# EAGLE design Humidity (EAGLE 9.6.2)
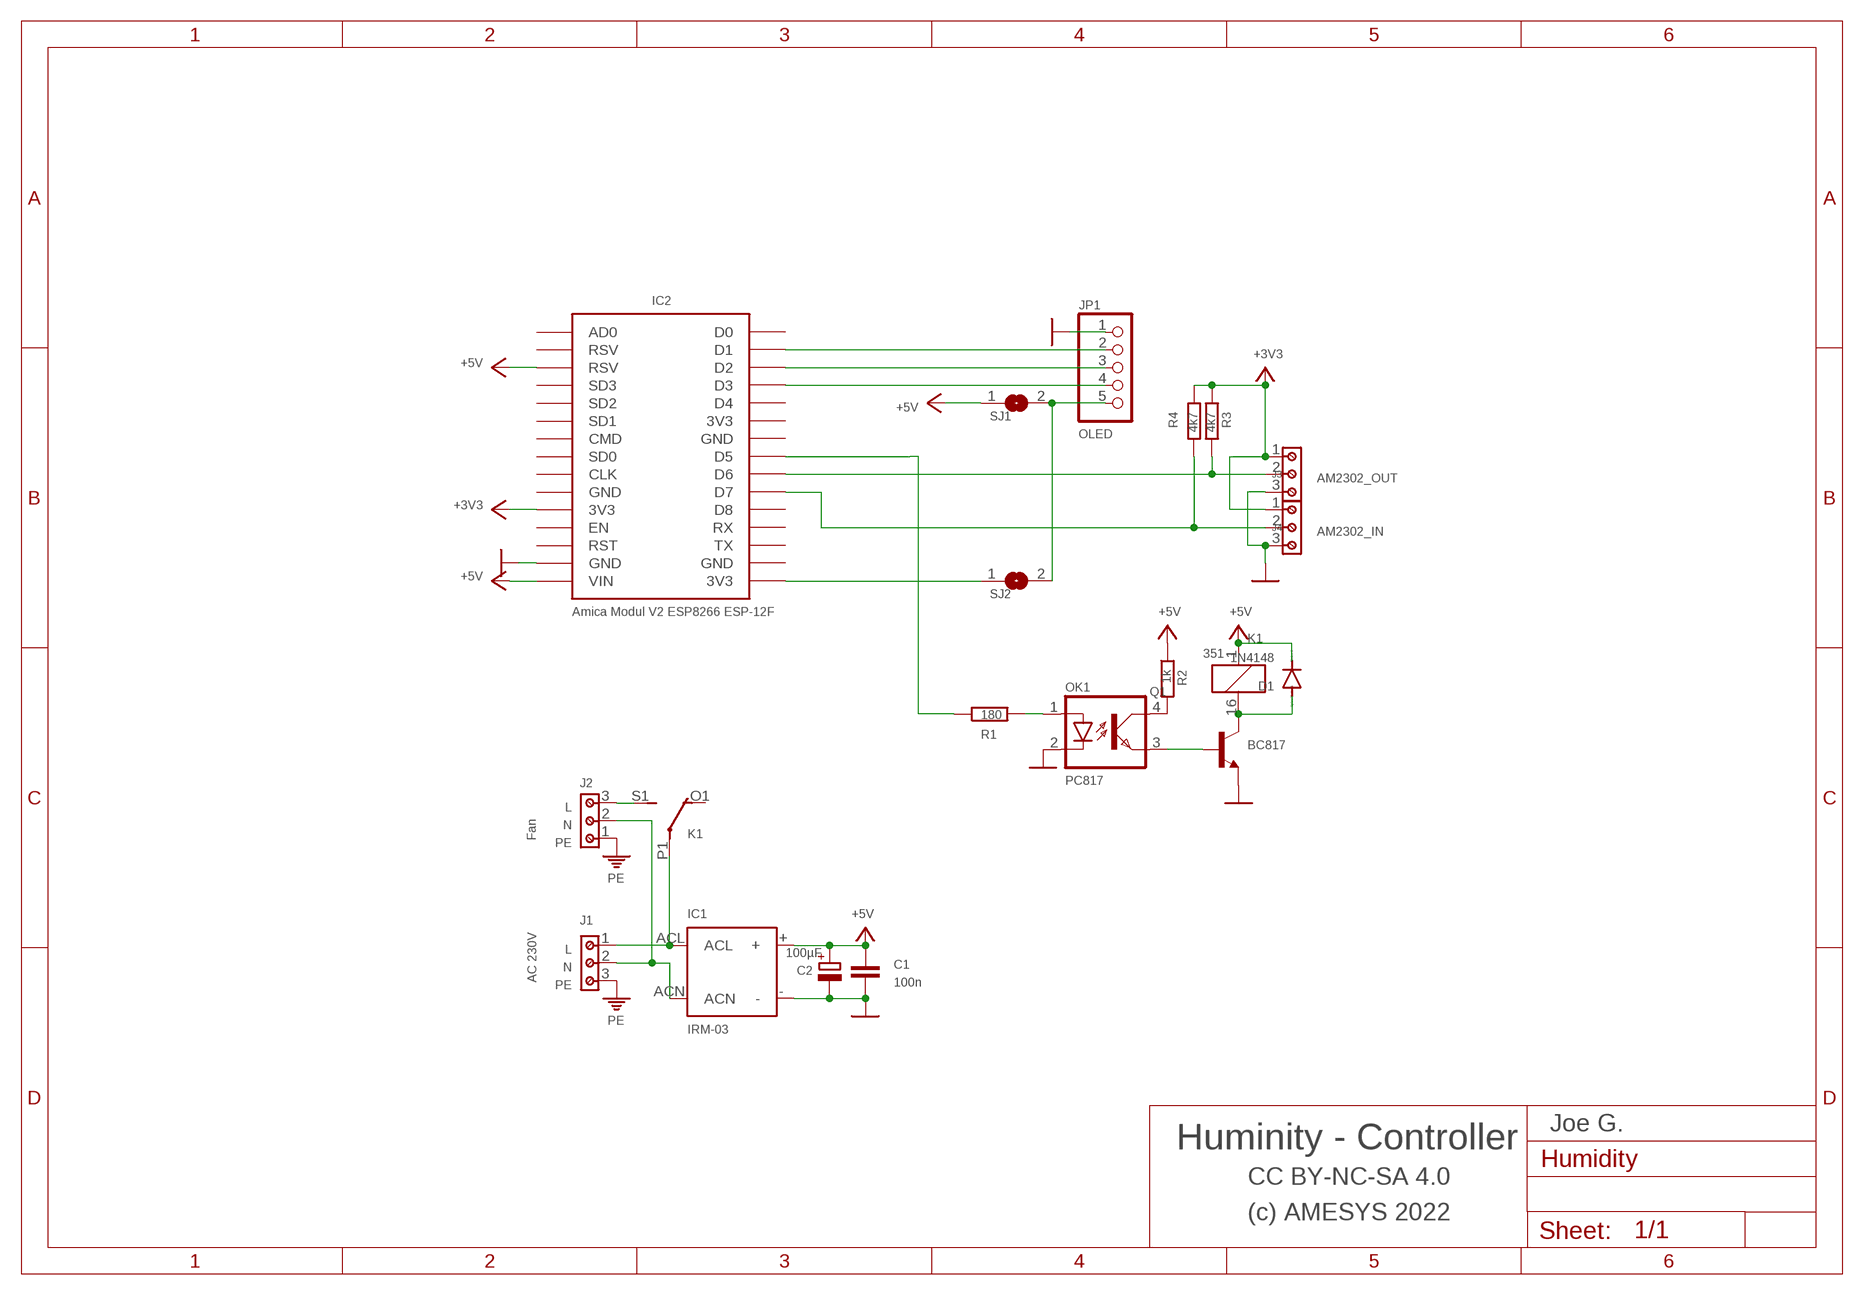
[diagram p0: schematic, sheet 1]

## Parts
C1  100n  C-EUC1206  [C1206]
C2  100µF  CPOL-EUSMCC  [SMC_C]
D1  1N4148  DIODE-SOD123  [SOD123]
IC1  IRM-03  [IRM-03]
IC2  Amica Modul V2 ESP8266 ESP-12F  ESP12E_DEVKIT  [ESP12E_DEVKIT]
J1  AC 230V  691216910003  [691216910003]
J2  Fan  691216910003  [691216910003]
J3  AM2302_OUT  691216710003  [691216710003]
J4  AM2302_IN  691216710003  [691216710003]
JP1  OLED  PINHD-1X5  [1X05]
K1  351  [351]
OK1  PC817  [DIL04]
Q1  BC817  TRANSISTOR-NPN_BC817SMD  [TRANSISTOR-NPN_SOT23-BEC]
R1  180  R-EU_R1206  [R1206]
R2  1k  R-EU_M1206  [M1206]
R3  4k7  R-EU_M1206  [M1206]
R4  4k7  R-EU_M1206  [M1206]
SJ1  SJ  [SJ]
SJ2  SJ  [SJ]

## Nets
+3V3: IC2.3V3@0(3V3) J3.1 J4.1 R3.1 R4.1
+5V: C1.1 C2.+ D1.C IC1.+ IC2.RSV@1(RSV) IC2.VIN K1.1 R2.1 SJ1.1
GND: C1.2 C2.- IC1.- IC2.GND@1(GND) J3.3 J4.3 JP1.1 OK1.2(C) Q1.E
N$1: IC2.D6 J3.2 R3.2
N$2: IC2.D7 J4.2 R4.2
N$3: JP1.5 SJ1.2 SJ2.2
N$4: IC1.ACL J1.1 K1.P1(2:P)
N$5: IC1.ACN J1.2 J2.2
N$6: OK1.1(A) R1.2
N$7: OK1.4(COL) R2.2
N$8: D1.A K1.16 Q1.C
N$9: OK1.3(EMIT) Q1.B
N$10: J2.3 K1.S1(2:S)
N$11: IC2.D1 JP1.2
N$12: IC2.D2 JP1.3
N$13: IC2.D3 JP1.4
N$14: IC2.3V3@2(3V3) SJ2.1
PE: J1.3 J2.1
REL: IC2.D5 R1.1
Unconnected: IC2.3V3@1(3V3) IC2.AD0 IC2.CLK IC2.CMD IC2.D0 IC2.D4 IC2.D8 IC2.EN IC2.GND@0(GND) IC2.GND@2(GND) IC2.GND@3(GND) IC2.RST IC2.RSV@0(RSV) IC2.RX IC2.SD0 IC2.SD1 IC2.SD2 IC2.SD3 IC2.TX K1.O1(2:O) K1.O2(3:O) K1.P2(3:P) K1.S2(3:S)

## Notes on the sheet
- L
- N
- PE
- L
- N
- PE
- Joe G.
- Huminity - Controller
- CC BY-NC-SA 4.0
- (c) AMESYS 2022

## Library data of the parts
C1 = rcl:C-EU: CAPACITOR, European symbol; SPICEPREFIX: C
C2 = rcl:CPOL-EU: POLARIZED CAPACITOR, European symbol; SPICEPREFIX: C
D1 = diode:DIODE-: DIODE
IC1 = meanwell:IRM-03
IC2 = ESP12E_DEVKIT:ESP12E_DEVKIT: ESP12E DEVKIT BOARD
J1 J2 = Eagle_WR-TBL Rising Cage Clamp (rev20a):691216910003: WR-TBL Serie 2169 - 7.50 mm Horizontal Entry Modular w. Rising Cage Clamp KIND PROPERTIES Pitch 7.5 mm MATERIAL PROPERTIES Insulator Material PA66 Insulator Flammability Rating UL94 V-0 Contact Material Copper Alloy Contact Plating Tin over Nickel Contact Type Stamped Terminal Screw Material Steel Terminal Screw Plating Zinc Wire Guard Material Copper Alloy GENERAL INFORMATION Operating Temperature -30 up to +120 °C Compliance ROHS & Reach ELECTRICAL PROPERTIES IR UL 14 A IR VDE 24 A Working Voltage [UL] 300 V (AC) Working Voltage [VDE] 750 V (AC) Withstanding Voltage [UL] 1600 V (AC) Withstanding Voltage [VDE] 3000 V (AC) Contact Resistance 20 mΩ MECHANICAL PROPERTIES Wire Strip Length 6 Screw M3 CERTIFICATION UL Approval E150931 VDE Approval 40021356 PACKAGING PROPERTIES Packaging Box <https://www.we-online.com/catalog/media/o32871v209%20Family_WR-TBL2_Series2169.jpg> Details see: https://www.we-online.com/catalog/en/TBL_7_50_2169_HORIZONTAL_ENTRY_MODULAR_69121691000x/ Updated by Ella Wu 2019-11-27 2019(C) Wurth Elektronik; IR-UL: 14A; IR-VDE: 24A; PART-NUMBER: 691216910003; PINS: 3; PITCH: 7.5mm; TYPE: Horizontal; WIRE: 12 to 30 (AWG) 3.31 to 0.0509 (mm²); WORKING-VOLTAGE-UL: 300V (AC); WORKING-VOLTAGE-VDE: 750V (AC)
J3 J4 = Eagle_WR-TBL Rising Cage Clamp (rev20a):691216710003: WR-TBL Serie 2167 - 5.00 mm Horizontal Entry Modular w. Rising Cage Clamp KIND PROPERTIES Pitch 5 mm MATERIAL PROPERTIES Insulator Material PA6/66 Insulator Flammability Rating UL94 V-0 Insulator Color Green Contact Material Copper Alloy Contact Plating Nickel over Tin Contact Type Stamped Terminal Screw Material Steel Terminal Screw Plating Zinc Wire Guard Material Copper Alloy GENERAL INFORMATION Operating Temperature -30 up to +120 °C Compliance Lead free / RoHS ELECTRICAL PROPERTIES IR UL 14 A IR VDE 24 A Working Voltage [UL] 300 V (AC) Working Voltage [VDE] 250 V (AC) Withstanding Voltage [UL] 1600 V (AC) Withstanding Voltage [VDE] 2000 V (AC) Contact Resistance 20 mΩ Contact Resistance [UL] 20 mΩ Contact Resistance [VDE] 20 mΩ MECHANICAL PROPERTIES Wire Strip Length 6 (mm) Screw M3 CERTIFICATION UL Approval E150931 CAT. N°: CLL (4) VDE Approval 40021356 VDE Approval 40021356 TYPE: CLL PACKAGING PROPERTIES Packaging Box <https://www.we-online.com/catalog/media/o32862v209%20Family_Con_TBL_Screw_RisingClamp_5_6912167100xx_pf2.jpg> Details see: https://www.we-online.com/catalog/en/TBL_5_00_2167_HORIZONTAL_ENTRY_W_RISING_CAGE_69121671000x/ Updated by Ella Wu 2019-11-22 2019(C) Wurth Elektronik; DATASHEET-URL: https://www.we-online.com/catalog/datasheet/691216710003.pdf; IR-UL: 14A; IR-VDE: 24A; MOUNT: THT; PART-NUMBER: 691216710003; PINS: 3; PITCH: 5mm; TYPE: Horizontal; WIRE: 30 to 12 (AWG) 0.05 to 3.31 (mm²); WORKING-VOLTAGE-UL: 300V (AC); WORKING-VOLTAGE-VDE: 250V (AC)
JP1 = pinhead:PINHD-1X5: PIN HEADER
K1 = relay:351: RELAY 2 x switch, Omron; OC_FARNELL: unknown; OC_NEWARK: unknown
OK1 = optocoupler:PC817: SHARP OPTO COUPLER; MPN: PC817X4J000F; OC_FARNELL: 9707727; OC_NEWARK: 97K7059
Q1 = Aeternum:TRANSISTOR-NPN_BC817*: NPN Transistor
R1-R4 = rcl:R-EU_: RESISTOR, European symbol; SPICEPREFIX: R
SJ1 SJ2 = jumper:SJ: SMD solder JUMPER

## Board
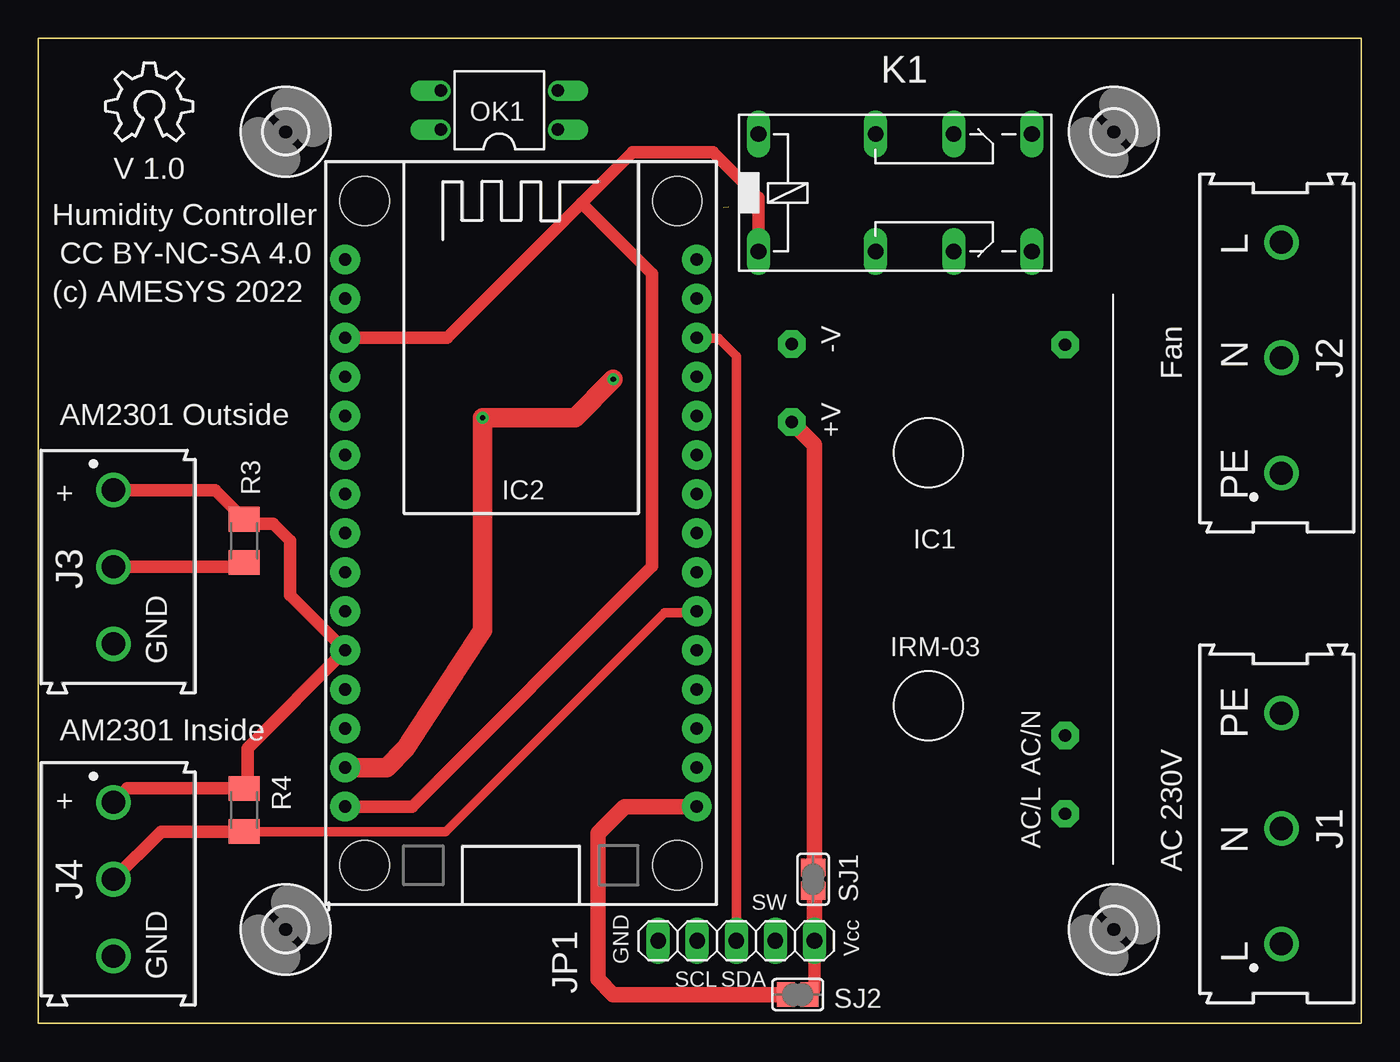
[diagram p1: board, top side]
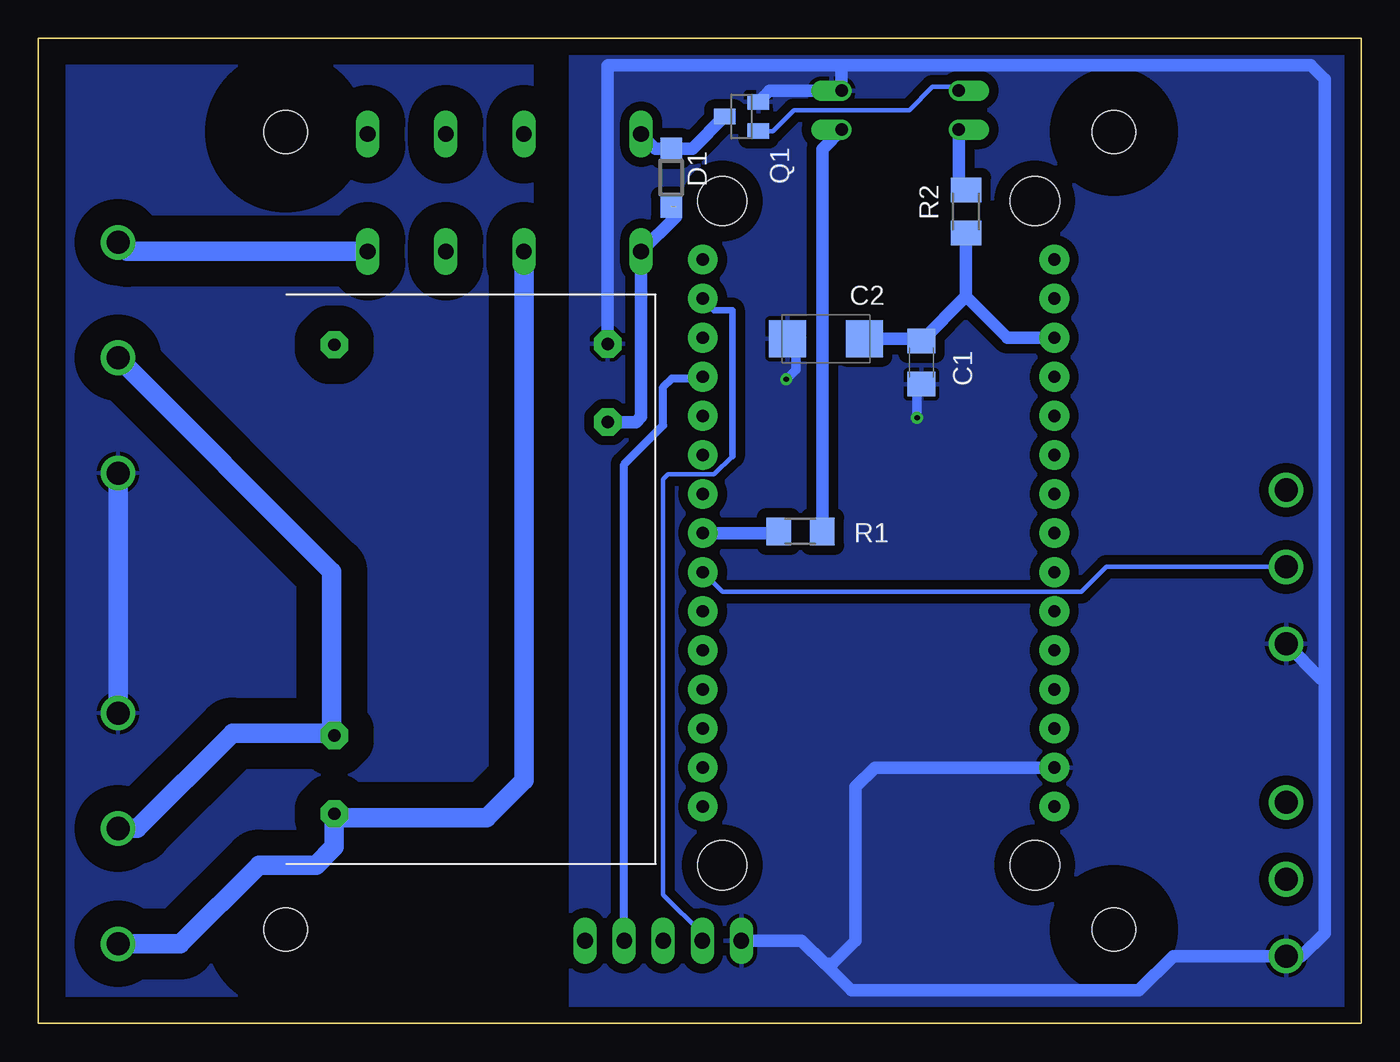
[diagram p2: board, bottom side, seen from below]

Size 86 x 64 mm. Coordinates in mm from the lower left corner, seen from the top.
Outline: 0,0 0,64 86,64 86,0 0,0
Copper layers (1*16): Top 0.035mm / dielectric 1.5mm / Bottom 0.035mm
Design rules "default": minimum track width 6mil, minimum drill 0.35mm, track to track 6mil, track to pad 6mil, pad to pad 6mil, via to via 6mil, smd to smd 6mil, copper to edge 40mil, drill to drill 6mil, minimum pad ring 10mil, minimum via ring 8mil, stop-mask expansion 4mil, vias tented up to drill 0mil, thermal gap 10mil

### Footprints (pad centres in the part's own frame; a part is rotated, then mirrored left to right if it is on the bottom)
C1206 = smd 1.6 x 1.8: 1 -1.4,0; 2 1.4,0
SMC_C = smd 2.4 x 2.4: + -2.5,0; - 2.5,0
SOD123 = smd 1.4 x 1.4: A 1.9,0; C -1.9,0
IRM-03 = drill 0.8 pad 1.778 octagon: + -10.72,-8.89; - -15.8,-8.89; ACL 14.74,8.89; ACN 9.66,8.89; NC -15.74,8.89
ESP12E_DEVKIT = drill 0.8 pad 1.93: 3V3@0 -11.43,-7.62; 3V3@1 11.43,5.08; 3V3@2 11.43,-17.78; AD0 -11.43,17.78; CLK -11.43,-2.54; CMD -11.43,2.54; D0 11.43,17.78; D1 11.43,15.24; D2 11.43,12.7; D3 11.43,10.16; D4 11.43,7.62; D5 11.43,0; D6 11.43,-2.54; D7 11.43,-5.08; D8 11.43,-7.62; EN -11.43,-10.16; GND@0 -11.43,-5.08; GND@1 -11.43,-15.24; GND@2 11.43,2.54; GND@3 11.43,-15.24; RST -11.43,-12.7; RSV@0 -11.43,15.24; RSV@1 -11.43,12.7; RX 11.43,-10.16; SD0 -11.43,0; SD1 -11.43,5.08; SD2 -11.43,7.62; SD3 -11.43,10.16; TX 11.43,-12.7; VIN -11.43,-17.78 | hole 3.2: -10.16,21.59; 10.16,21.59; 10.16,-21.59; -10.16,-21.59
691216910003 = drill 1.5: 1 -7.5,0; 2 0,0; 3 7.5,0
691216710003 = drill 1.5: 1 -5,0; 2 0,0; 3 5,0
1X05 = drill 1.016 long: 1 -5.08,0; 2 -2.54,0; 3 0,0; 4 2.54,0; 5 5.08,0
351 = drill 1.016 long: 1 -3.81,-3.81; 16 -3.81,3.81; O1 8.89,-3.81; O2 8.89,3.81; P1 3.81,-3.81; P2 3.81,3.81; S1 13.97,-3.81; S2 13.97,3.81
DIL04 = drill 0.813 offset: 1 -1.27,-3.81; 2 1.27,-3.81; 3 1.27,3.81; 4 -1.27,3.81
TRANSISTOR-NPN_SOT23-BEC = smd 1 x 1.4: B -0.95,-1.1; C 0,1.1; E 0.95,-1.1
R1206 = smd 1.6 x 1.803: 1 -1.422,0; 2 1.422,0
M1206 = smd 1.6 x 2: 1 -1.4,0; 2 1.4,0
SJ = smd 1.168 x 1.6: 1 -0.762,0; 2 0.762,0
2,8 = hole 2.8: 0,0

### Placement (x,y rotation side)
C1  28.59,42.93 270 bottom
C2  34.8,44.48 180 bottom
D1  44.86,54.95 90 bottom
IC1  57.88,28.35 270 top
IC2  31.38,31.85 0 top
J1  80.83,12.65 90 top
J2  80.83,43.25 90 top
J3  4.88,29.65 270 top
J4  4.88,9.35 270 top
JP1  45.38,5.35 0 top
K1  50.62,53.97 0 top
OK1  29.96,59.34 90 top
Q1  40.28,58.93 90 bottom
R1  36.45,31.96 0 bottom
R2  25.68,52.75 90 bottom
R3  13.38,31.35 270 top
R4  13.38,13.85 270 top
SJ1  50.38,9.35 270 top
SJ2  49.38,1.85 0 top
U$1  [2,8]  16.07,57.93 0 top
U$3  [2,8]  16.07,6.08 0 top
U$4  [2,8]  69.92,6.08 0 top
U$5  [2,8]  69.92,57.93 0 top
U$7  [OSHW_8X200_NOTEXT]  4.38,57.35 0 top

### Tracks (layer width: path | path; a pad name or v marks a point on that pad's centre or on a via)
+3V3
  Top 0.152: 13.59,32.46 R3.1 | 13.59,15.55 R4.1
  Top 0.813: J4.1 5.78,15.25 R4.1 | J3.1 11.47,34.65 R3.1 | 13.59,15.55 13.59,17.88 IC2.3V3@0 16.38,27.8 16.38,31.35 15.26,32.46 13.59,32.46
+5V  (1 unrouted)
  Top 0.813: IC2.RSV@1 26.57,44.55 35.31,53.29 | 35.31,53.29 38.62,56.6 43.88,56.6 46.81,53.66 K1.1 | IC2.VIN 24.29,14.07 39.9,29.68 39.9,48.7 35.31,53.29
  Top 1.016: IC1.+ 50.45,37.6 50.45,10.19 SJ1.1
  Bottom 0.813: 25.68,47.23 C1.1 28.73,44.48 C2.+ | 25.68,47.23 R2.1 | IC1.+ 47.16,39.07 46.81,39.41 K1.1 44.56,52.42 44.56,53.03 | IC2.RSV@1 23,44.55 25.68,47.23
GND  (via drill 0.35)
  Top 1.27: v37.38,41.85 34.88,39.35 v28.88,39.35 28.88,25.54 23.88,17.85 22.64,16.61 IC2.GND@1
  Bottom 0.152: 36.76,43.89 37.21,44.35 C2.- | C1.2 28.68,41.45
  Bottom 0.61: 28.68,41.45 28.88,41.26 v28.88,39.35 | 36.76,43.89 36.76,42.47 v37.38,41.85
  Bottom 0.813: Q1.E 38.45,60.61 OK1.2 33.77,62.25 | J3.3 2.58,22.35 | 2.58,22.35 2.38,22.35 2.38,5.85 3.88,4.35 J4.3 12.2,4.35 14.43,2.12 33.14,2.12 34.88,3.85 | 33.77,62.25 48.98,62.25 48.98,62.24 IC1.- | 33.77,62.25 3.27,62.25 2.38,61.35 2.38,22.55 2.58,22.35 | IC2.GND@1 31.61,16.61 32.88,15.35 32.88,5.35 34.38,3.85 34.88,3.85 | JP1.1 36.38,5.35 34.88,3.85
  pour Bottom (isolate 0.61): 0.38,63.35 0.38,0.35 51.38,0.35 51.38,63.35
N$1
  Top 0.813: J3.2 13.07,29.65 R3.2
  Bottom 0.305: J3.2 16.57,29.65 18.18,28.04 41.53,28.04 IC2.D6
N$2
  Top 0.152: 42.7,26.67 IC2.D7
  Top 0.61: 42.7,26.67 40.7,26.67 26.48,12.45 R4.2
  Top 0.813: J4.2 7.97,12.45 R4.2
N$3
  Top 0.813: SJ2.2 50.45,2.17 JP1.5
  Top 1.016: SJ1.2 50.45,8.51 JP1.5
N$4
  Bottom 1.27: J1.1 76.78,5.15 71.66,10.27 67.95,10.27 66.77,11.46 IC1.ACL 66.5,13.35 56.88,13.35 54.44,15.79 K1.P1
N$5
  Bottom 1.27: J1.2 79.58,12.65 73.38,18.85 66.92,18.85 | 66.92,18.85 IC1.ACN | J2.2 66.92,29.35 66.92,18.85
N$6
  Bottom 0.813: R1.2 35.03,56.81 OK1.1
N$7
  Bottom 0.152: R2.2 25.78,54.26 25.78,54.41 26.16,54.57
  Bottom 0.813: OK1.4 26.16,54.57
N$8
  Bottom 0.152: 44.83,56.83 D1.A 44.88,56.83
  Bottom 0.813: Q1.C 43.48,56.83 44.83,56.83 | K1.16 45.87,56.83 44.88,56.83
N$9
  Bottom 0.305: Q1.B 38.24,57.98 36.88,59.35 29.38,59.35 27.88,60.85 26.39,60.85 OK1.3
N$10
  Bottom 1.27: K1.S1 80.23,50.16 J2.3
N$11
  Bottom 0.305: 40.88,36.85 42.06,35.66 45.06,35.66 45.38,35.35 45.38,8.35 42.84,5.81 JP1.2
  Bottom 0.406: IC2.D1 42.06,46.35 40.88,46.35 40.88,36.85
N$12
  Top 0.152: 42.85,44.5 IC2.D2
  Top 0.61: JP1.3 45.38,43.35 44.22,44.5 42.85,44.5
N$13
  Bottom 0.152: 42.85,41.91 IC2.D3
  Bottom 0.508: JP1.4 47.91,36.31 45.38,38.85 45.38,41.35 44.81,41.91 42.85,41.91
N$14
  Top 1.016: SJ2.1 37.38,1.85 36.38,2.85 36.38,12.35 38.09,14.07 IC2.3V3@2
PE
  Bottom 1.27: J1.3 J2.1
  pour Bottom (isolate 1.676): 53.88,62.85 85.38,63.85 85.38,1.35 53.88,1.35
REL
  Bottom 0.813: IC2.D5 37.98,31.85 R1.1

### Text on the board
tNames: V 1.0 | Humidity Controller | L | CC BY-NC-SA 4.0 | (c) AMESYS 2022 | N | Fan | AM2301 Outside | PE | + | GND | PE | AM2301 Inside | + | N | AC 230V | SW | L | GND | Vcc | GND | SCL | SDA